# EAGLE design Teensy4_HiFiBerry_r1_0_TopMount (EAGLE 9.6.2)
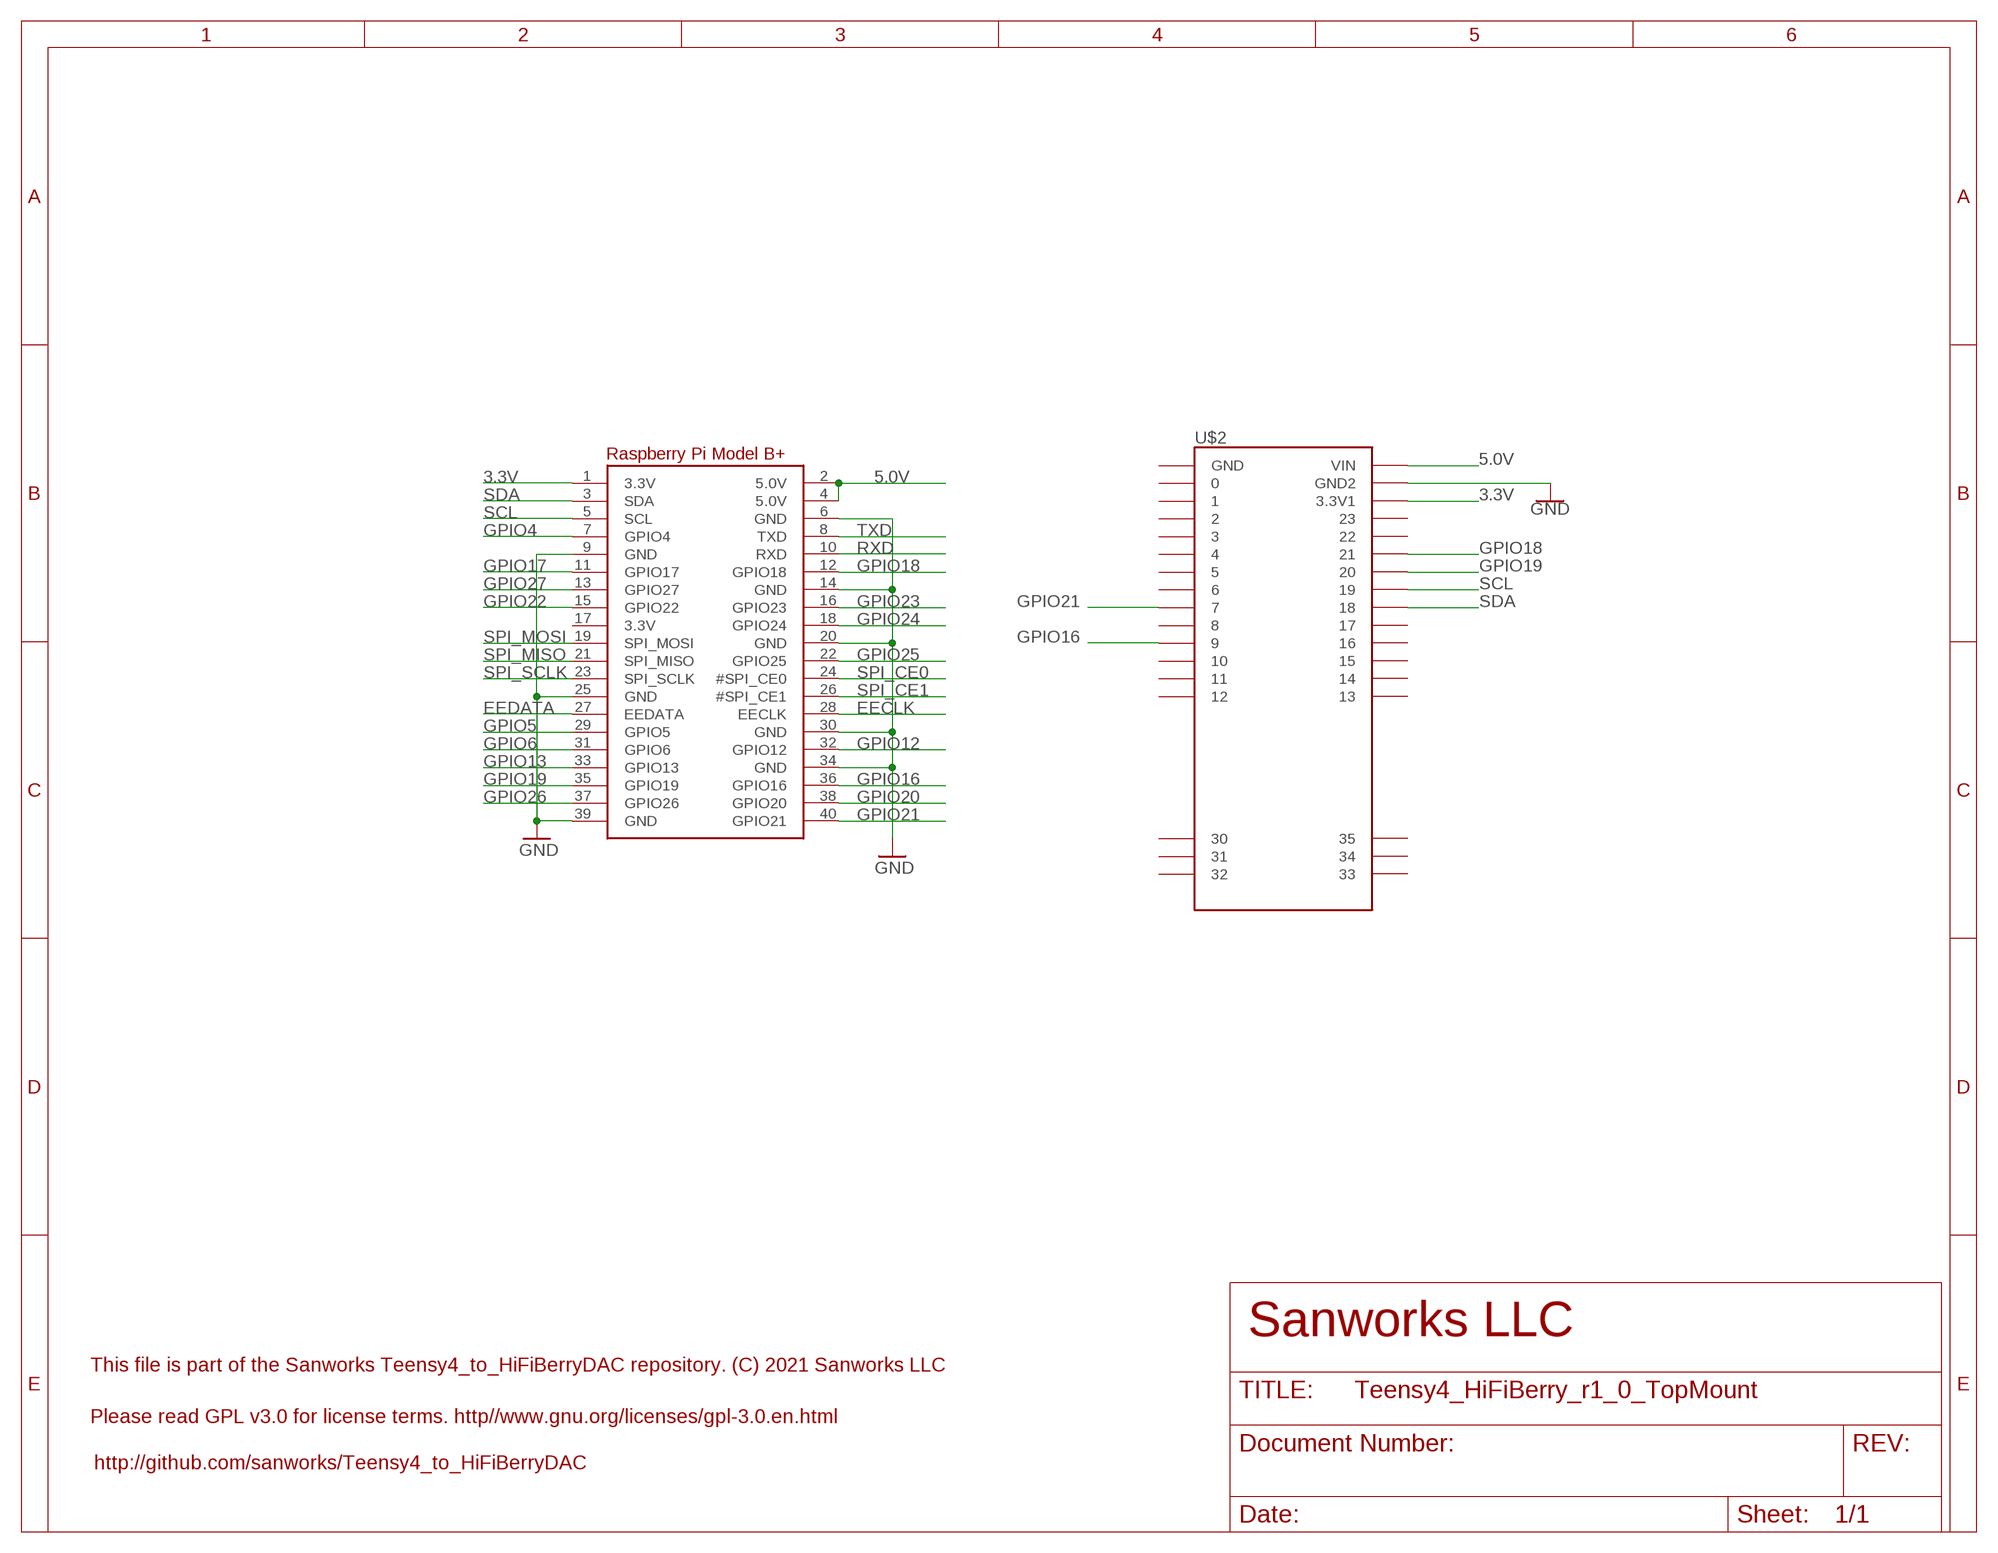
[diagram p0: schematic, sheet 1]

## Parts
RPI1  RASPBERRYPI_BPLUS_IDC  [2X20]
U$2  TEENSY4-4.1_FORAUDIO  [TEENSY4-4.1_FORAUDIO]

## Nets
3.3V: RPI1.1(3.3V) U$2.3V3_LO(3.3V1)
5.0V: RPI1.2(5.0V) RPI1.4(5.0V) U$2.VIN
EECLK: RPI1.28(EECLK)
EEDATA: RPI1.27(EEDATA)
GND: RPI1.6(GND) RPI1.9(GND) RPI1.14(GND) RPI1.20(GND) RPI1.25(GND) RPI1.30(GND) RPI1.34(GND) RPI1.39(GND) U$2.GND(GND2)
GPIO4: RPI1.7(GPIO4)
GPIO5: RPI1.29(GPIO5)
GPIO6: RPI1.31(GPIO6)
GPIO12: RPI1.32(GPIO12)
GPIO13: RPI1.33(GPIO13)
GPIO16: RPI1.36(GPIO16) U$2.9
GPIO17: RPI1.11(GPIO17)
GPIO18: RPI1.12(GPIO18) U$2.21/A7
GPIO19: RPI1.35(GPIO19) U$2.20/A6
GPIO20: RPI1.38(GPIO20)
GPIO21: RPI1.40(GPIO21) U$2.7
GPIO22: RPI1.15(GPIO22)
GPIO23: RPI1.16(GPIO23)
GPIO24: RPI1.18(GPIO24)
GPIO25: RPI1.22(GPIO25)
GPIO26: RPI1.37(GPIO26)
GPIO27: RPI1.13(GPIO27)
RXD: RPI1.10(RXD)
SCL: RPI1.5(SCL) U$2.19/A5/SCL
SDA: RPI1.3(SDA) U$2.18/A4/SDA
SPI_CE0: RPI1.24(#SPI_CE0)
SPI_CE1: RPI1.26(#SPI_CE1)
SPI_MISO: RPI1.21(SPI_MISO)
SPI_MOSI: RPI1.19(SPI_MOSI)
SPI_SCLK: RPI1.23(SPI_SCLK)
TXD: RPI1.8(TXD)
Unconnected: RPI1.17(3.3V) U$2.0/RX U$2.1/TX U$2.2 U$2.3 U$2.4 U$2.5 U$2.6 U$2.8 U$2.10/CS U$2.11/MOSI U$2.12/MISO U$2.13/SCK U$2.14/A0 U$2.15/A1 U$2.16/A2 U$2.17/A3 U$2.22/A8 U$2.23/A9 U$2.30 U$2.31/A12 U$2.32 U$2.33 U$2.34 U$2.35 U$2.AGND(GND)

## Notes on the sheet
- Sanworks LLC
- This file is part of the Sanworks Teensy4_to_HiFiBerryDAC repository. (C) 2021 Sanworks LLC
- Please read GPL v3.0 for license terms. http//www.gnu.org/licenses/gpl-3.0.en.html
- http://github.com/sanworks/Teensy4_to_HiFiBerryDAC

## Library data of the parts
RPI1 = microbuilder:RASPBERRYPI_BPLUS
U$2 = teensy4.1.dist:TEENSY4-4.1_FORAUDIO

## Board
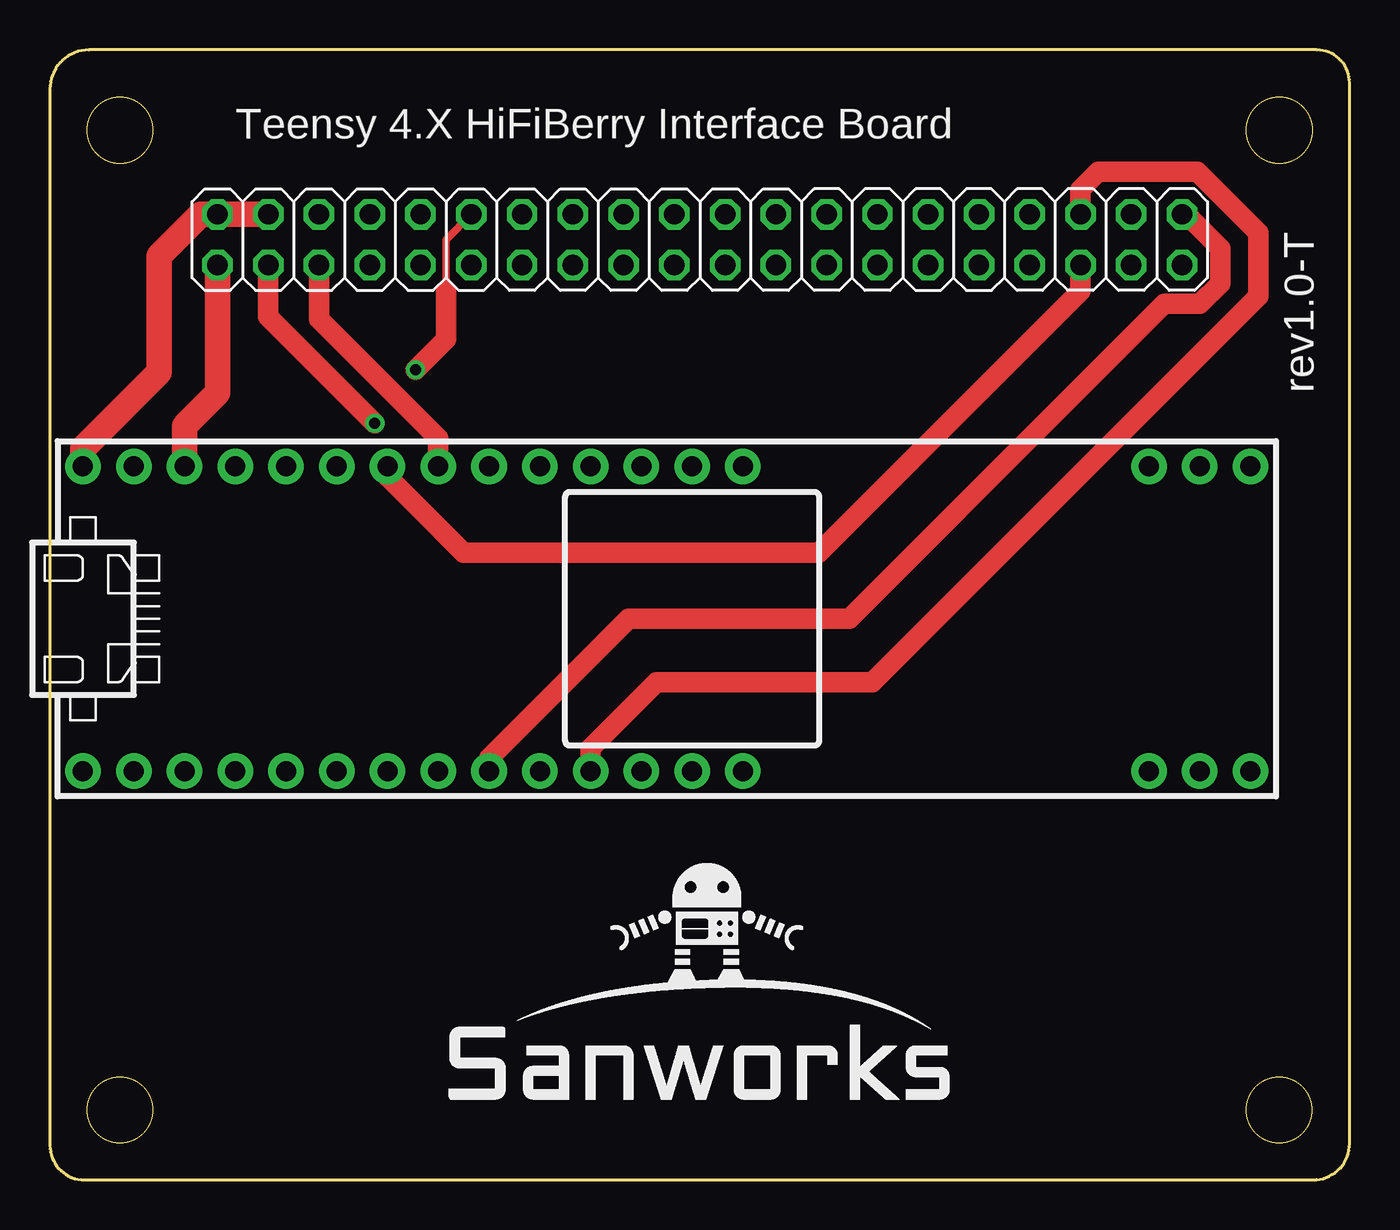
[diagram p1: board, top side]
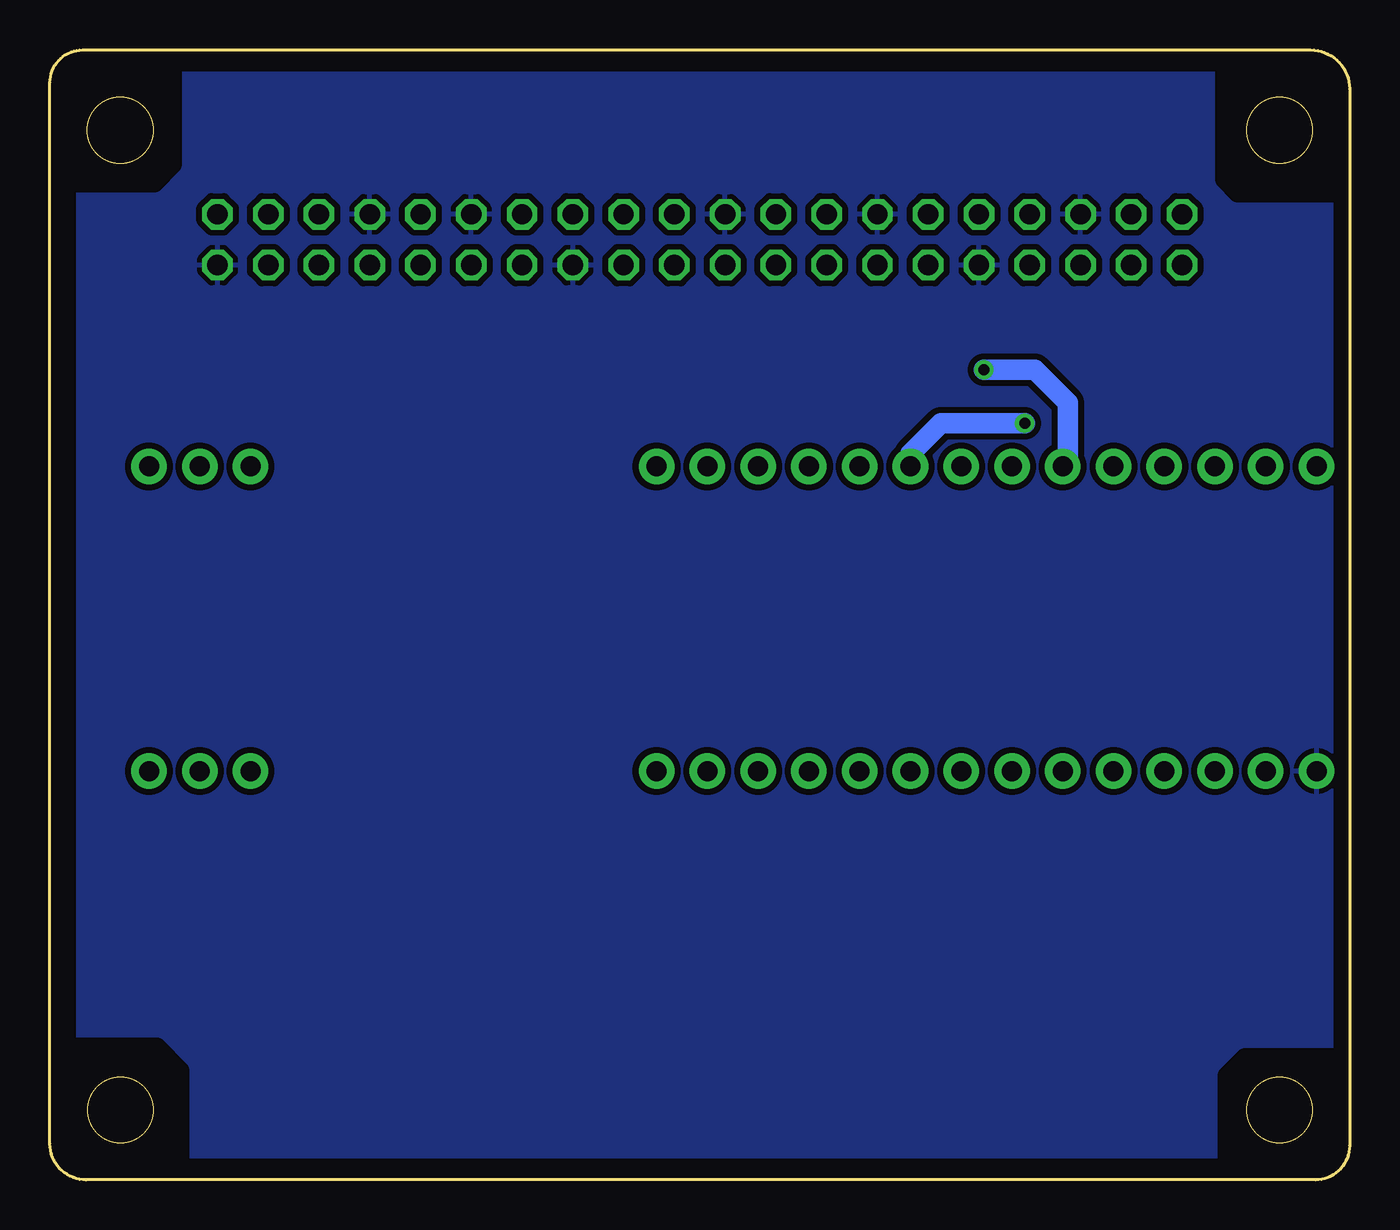
[diagram p2: board, bottom side, seen from below]

Size 65.02 x 56.52 mm. Coordinates in mm from the lower left corner, seen from the top.
Outline: 0,19.56 0,19.68
Outline: 0,54.57 0,1.71 arc90 1.71,0 63.22,0 arc90 65.02,1.81 65.02,54.88 arc90 63.39,56.52 1.95,56.52 arc90 0,54.57
Outline: circle at 3.51,52.5 radius 1.65
Outline: circle at 3.51,3.5 radius 1.65
Outline: circle at 61.51,52.5 radius 1.65
Outline: circle at 61.5,3.5 radius 1.65
Copper layers (1*16): Top 0.035mm / dielectric 1.5mm / Bottom 0.035mm
Design rules "adafruit *": minimum track width 8mil, minimum drill 15.5mil, track to track 12mil, track to pad 12mil, pad to pad 12mil, via to via 12mil, smd to smd 8mil, copper to edge 10mil, drill to drill 8mil, minimum pad ring 10mil, minimum via ring 8mil, stop-mask expansion 2mil, vias tented up to drill 20mil, thermal gap 10mil
bRestrict: area 0.9,49.4 to 6.2,55.6; area 58.9,49.9 to 64,55.6; area 58.5,0.6 to 64.1,6.6; area 0.4,0.6 to 6.1,6.1

### Footprints (pad centres in the part's own frame; a part is rotated, then mirrored left to right if it is on the bottom)
2X20 = drill 1.016 octagon: 1 -24.13,-1.27; 2 -24.13,1.27; 3 -21.59,-1.27; 4 -21.59,1.27; 5 -19.05,-1.27; 6 -19.05,1.27; 7 -16.51,-1.27; 8 -16.51,1.27; 9 -13.97,-1.27; 10 -13.97,1.27; 11 -11.43,-1.27; 12 -11.43,1.27; 13 -8.89,-1.27; 14 -8.89,1.27; 15 -6.35,-1.27; 16 -6.35,1.27; 17 -3.81,-1.27; 18 -3.81,1.27; 19 -1.27,-1.27; 20 -1.27,1.27; 21 1.27,-1.27; 22 1.27,1.27; 23 3.81,-1.27; 24 3.81,1.27; 25 6.35,-1.27; 26 6.35,1.27; 27 8.89,-1.27; 28 8.89,1.27; 29 11.43,-1.27; 30 11.43,1.27; 31 13.97,-1.27; 32 13.97,1.27; 33 16.51,-1.27; 34 16.51,1.27; 35 19.05,-1.27; 36 19.05,1.27; 37 21.59,-1.27; 38 21.59,1.27; 39 24.13,-1.27; 40 24.13,1.27
TEENSY4-4.1_FORAUDIO = drill 1 pad 1.778: 0/RX -27.94,-7.62; 1/TX -25.4,-7.62; 2 -22.86,-7.62; 3 -20.32,-7.62; 3V3_LO -25.4,7.62; 4 -17.78,-7.62; 5 -15.24,-7.62; 6 -12.7,-7.62; 7 -10.16,-7.62; 8 -7.62,-7.62; 9 -5.08,-7.62; 10/CS -2.54,-7.62; 11/MOSI 0,-7.62; 12/MISO 2.54,-7.62; 13/SCK 2.54,7.62; 14/A0 0,7.62; 15/A1 -2.54,7.62; 16/A2 -5.08,7.62; 17/A3 -7.62,7.62; 18/A4/SDA -10.16,7.62; 19/A5/SCL -12.7,7.62; 20/A6 -15.24,7.62; 21/A7 -17.78,7.62; 22/A8 -20.32,7.62; 23/A9 -22.86,7.62; 30 22.86,-7.62; 31/A12 25.4,-7.62; 32 27.94,-7.62; 33 27.94,7.62; 34 25.4,7.62; 35 22.86,7.62; AGND -27.94,7.62; GND -30.48,-7.62; VIN -30.48,7.62

### Placement (x,y rotation side)
RPI1  32.51,47.03 0 top
U$1  [SANWORKS_LOGO]  19.68,3.81 0 top
U$2  32.13,28.07 0 top

### Tracks (layer width: path | path; a pad name or v marks a point on that pad's centre or on a via)
3.3V
  Top 1.27: U$2.3V3_LO 6.73,37.72 8.38,39.37 RPI1.1
5.0V
  Top 1.27: RPI1.4 RPI1.2 7.53,48.3 5.46,46.23 5.46,40.39 1.65,36.58 U$2.VIN
GND
  pour Bottom: 62.74,55.37 2.03,55.37 0.89,54.23 0.89,2.67 2.41,1.14 63.63,1.14 63.63,54.48
GPIO16
  Top 1.016: RPI1.36 51.56,49.53 52.45,50.42 57.4,50.42 60.45,47.37 60.45,44.19 41.15,24.89 30.35,24.89 27.05,21.59 U$2.9
GPIO18  (via drill 0.55)
  Top 0.381: 19.81,44.45 19.81,47.03 RPI1.12
  Top 1.016: v18.29,40.51 19.81,42.04 19.81,44.45
  Bottom 1.016: U$2.21/A7 14.1,35.94 14.1,38.86 15.75,40.51 v18.29,40.51
GPIO19
  Top 1.016: U$2.20/A6 16.89,35.18 20.7,31.37 38.48,31.37 51.56,44.45 RPI1.35
GPIO21
  Top 1.016: U$2.7 21.97,21.08 28.96,28.07 40.01,28.07 55.75,43.81 57.53,43.81 58.55,44.83 58.55,46.61 56.86,48.3 RPI1.40
SCL
  Top 1.016: U$2.19/A5/SCL 19.43,37.08 13.46,43.05 RPI1.5
SDA  (via drill 0.55)
  Top 1.016: RPI1.3 10.92,43.18 v16.26,37.85
  Bottom 1.016: v16.26,37.85 20.45,37.85 21.97,36.32 U$2.18/A4/SDA

### Text on the board
tPlace: Teensy 4.X HiFiBerry Interface Board | rev1.0-T
tSilk: + | + | + | +